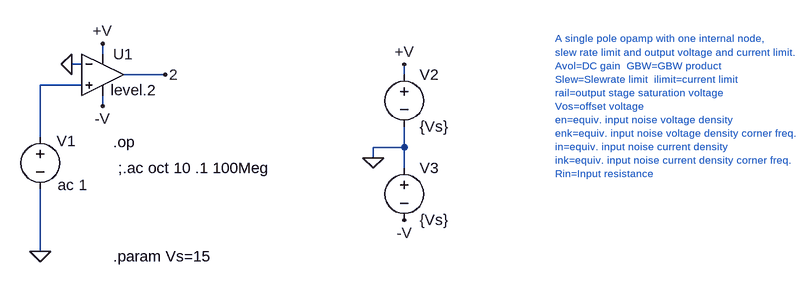
[diagram p0: schematic LarguraBanda.asc]
LarguraBanda.asc, the LTspice schematic file:
Version 4
SHEET 1 1380 680
WIRE 80 80 80 64
WIRE 48 96 32 96
WIRE 176 112 112 112
WIRE 544 112 544 96
WIRE 48 128 -16 128
WIRE 80 160 80 144
WIRE -16 208 -16 128
WIRE 544 224 544 192
WIRE 544 224 496 224
WIRE 496 240 496 224
WIRE 544 256 544 224
WIRE -16 384 -16 288
FLAG -16 384 0
FLAG 80 64 +V
FLAG 80 160 -V
FLAG 32 96 0
FLAG 176 112 2
FLAG 496 240 0
FLAG 544 96 +V
FLAG 544 336 -V
SYMBOL voltage -16 192 R0
WINDOW 0 25 22 Left 2
WINDOW 3 27 90 Left 2
SYMATTR InstName V1
SYMATTR Value ac 1
SYMBOL opamps\\UniversalOpamp2 80 112 R0
WINDOW 38 12 24 Left 2
SYMATTR InstName U1
SYMATTR Value2 Avol=1Meg GBW=0.8Meg Slew=10Meg
SYMBOL voltage 544 96 R0
SYMATTR InstName V2
SYMATTR Value {Vs}
SYMBOL voltage 544 240 R0
WINDOW 123 0 0 Left 0
WINDOW 39 0 0 Left 0
SYMATTR InstName V3
SYMATTR Value {Vs}
TEXT 104 256 Left 2 !;.ac oct 10 .1 100Meg
TEXT 776 56 Left 1 ;A single pole opamp with one internal node,\nslew rate limit and output voltage and current limit.\nAvol=DC gain  GBW=GBW product\nSlew=Slewrate limit  ilimit=current limit\nrail=output stage saturation voltage\nVos=offset voltage\nen=equiv. input noise voltage density\nenk=equiv. input noise voltage density corner freq.\nin=equiv. input noise current density\nink=equiv. input noise current density corner freq.\nRin=Input resistance
TEXT 96 392 Left 2 !.param Vs=15
TEXT 96 216 Left 2 !.op

The netlist it stands for:
* LarguraBanda.asc
V1 N001 0 ac 1
XU1 N001 0 +V -V 2 level.2 Avol=1Meg GBW=0.8Meg Slew=10Meg ilimit=25m rail=0 Vos=0 phimargin=45 en=0 enk=0 in=0 ink=0 Rin=500Meg  ; pins IN+ IN- V+ V- OUT
V2 +V 0 {Vs}
V3 0 -V {Vs}
;.ac oct 10 .1 100Meg
* A single pole opamp with one internal node,
* slew rate limit and output voltage and current limit.
* Avol=DC gain  GBW=GBW product
* Slew=Slewrate limit  ilimit=current limit
* rail=output stage saturation voltage
* Vos=offset voltage
* en=equiv. input noise voltage density
* enk=equiv. input noise voltage density corner freq.
* in=equiv. input noise current density
* ink=equiv. input noise current density corner freq.
* Rin=Input resistance
.param Vs=15
.op
.lib UniversalOpamps2.sub
.backanno
.end